# Altium schematic sheet External Connection.SchDoc
size 420 x 297 mm; Address1: Address1; Address2: Address2; Address3: Address3; Address4: Address4; SheetNumber: 4; SheetTotal: 10; DocumentType: Схема электрическая принципиальная
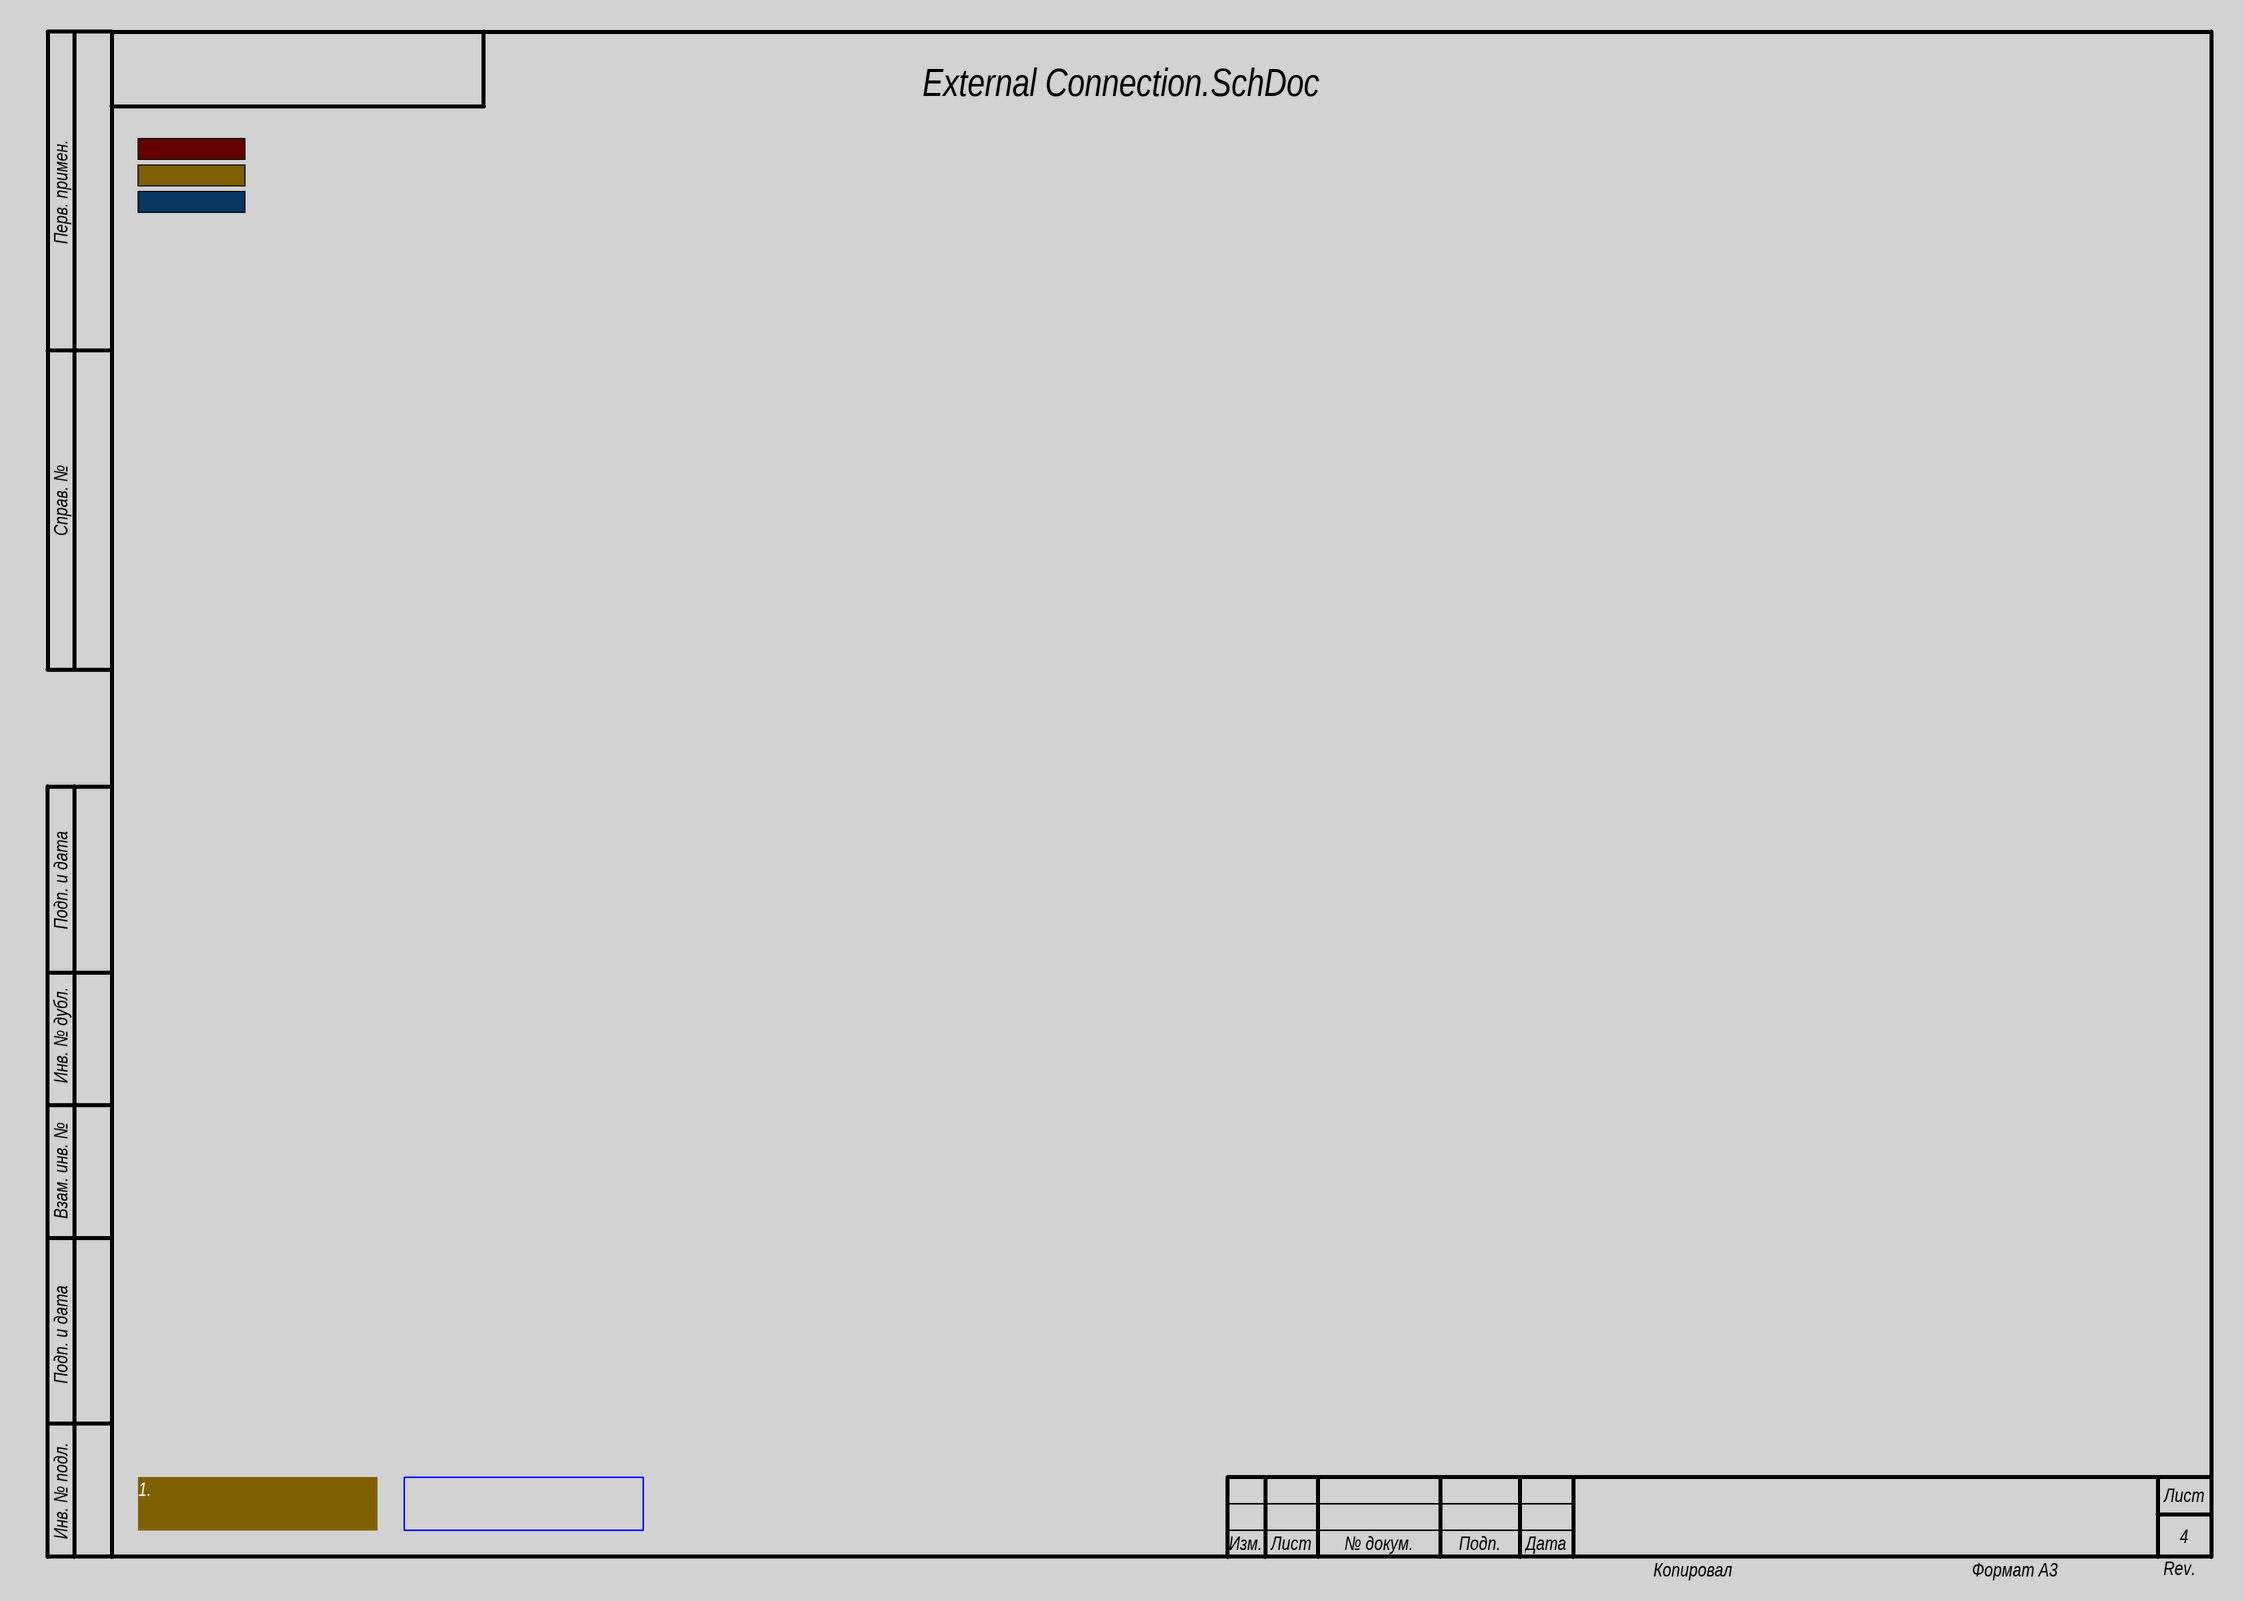
[diagram p0: External Connection.SchDoc]

## Ports
 (in)

## Notes on the sheet
- 1.
- Rev.
- Перв. примен.
- Справ. №
- Подп. и дата
- Инв. № дубл.
- Взам. инв. №
- Инв. № подл.
- Изм.
- Лист
- № докум.
- Подп.
- Дата
- Копировал
- Формат А3